# EAGLE design Lora Shield v1.1.1 (EAGLE 6.6.0)
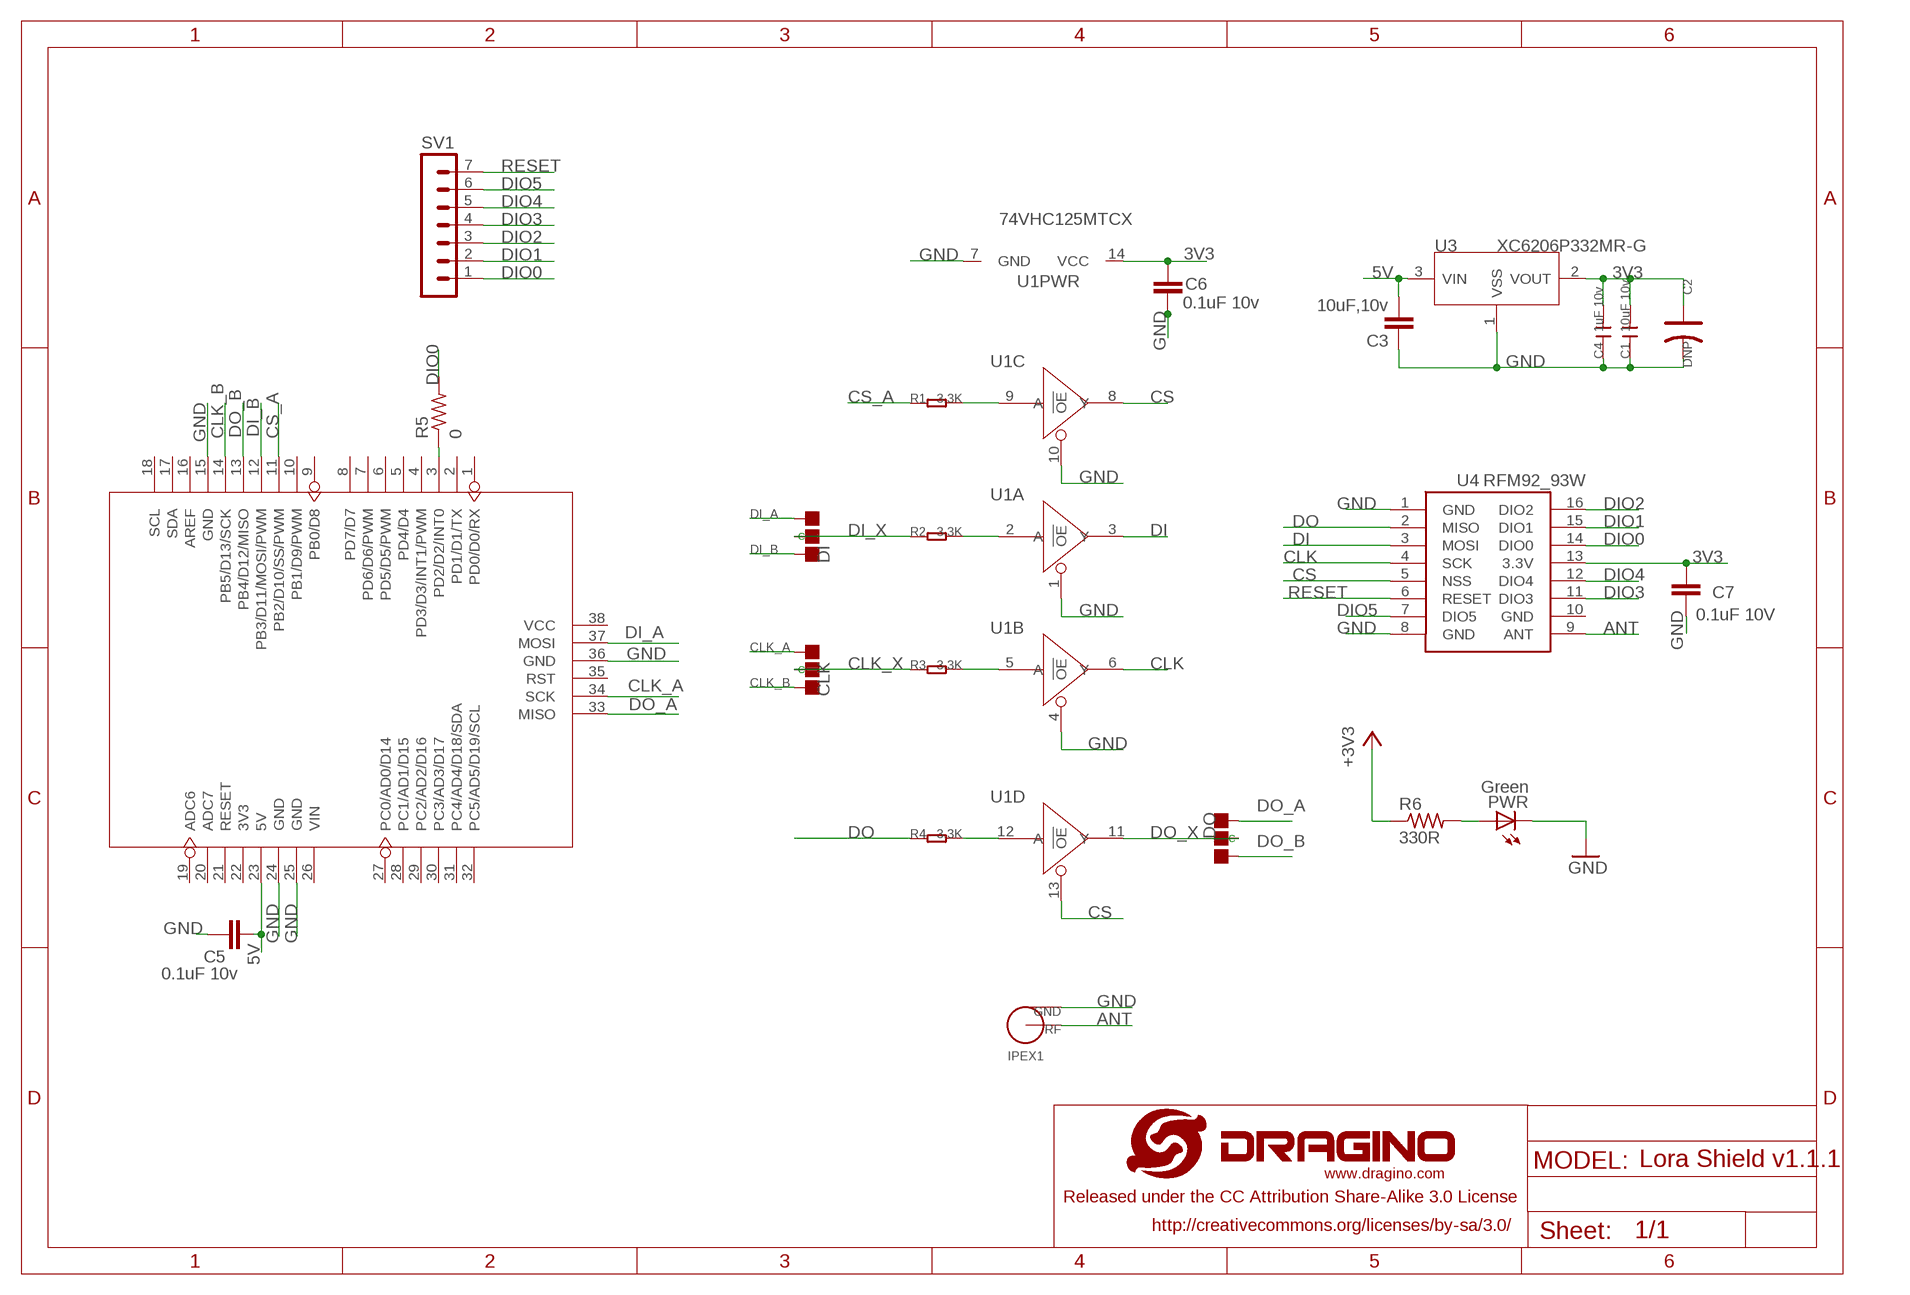
[diagram p0: schematic, sheet 1]

## Parts
C1  10uF 10v  C-0805  [C0805]
C2  DNP  CAP-AVX-A  [AVX-A]
C3  10uF,10v  C-EUC0805  [C0805]
C4  1uF 10v  C-0805  [C0805]
C5  0.1uF 10v  C-EUC0805  [C0805]
C6  0.1uF 10v  C-EUC0805  [C0805]
C7  0.1uF 10V  C-EUC0402  [C0402]
CLK  PAD-JUMPER-3P-40*40  [3P-SMD-4.1X1.5]
DI  PAD-JUMPER-3P-40*40  [3P-SMD-4.1X1.5]
DO  PAD-JUMPER-3P-40*40  [3P-SMD-4.1X1.5]
IPEX1  I-PEX  [I-PEX]
PWR  Green  LEDCHIP-LED0603  [CHIP-LED0603]
R1  3.3K  R-0603  [R0603]
R2  3.3K  R-0603  [R0603]
R3  3.3K  R-0603  [R0603]
R4  3.3K  R-0603  [R0603]
R5  0  R-US_R0603  [R0603]
R6  330R  R-US_R0402  [R0402]
SV1  MA07-1  [MA07-1]
U1  74VHC125MTCX  74VHC125PW  [TSSOP14]
U3  XC6206P332MR-G  XC6206MR  [SOT23]
U4  RFM92_93W  [RFM92_93W]
U5  MOUDLE_ARDUINO-38PMOUDLE_ARDUIN-328P-S  [MOUDLE_ARDUINO-328P_S]
U$1  LOGO-NEW  [LOGO-SILK-NEW]

## Nets
3V3: C1.2 C2.+ C4.2 C6.2 C7.2 R6.1 U1.14(PWR:VCC) U3.2(VOUT) U4.13(3.3V) ; supply symbol labelled +3V3
5V: C3.2 C5.2 U3.3(VIN) U5.23(5V)
ANT: IPEX1.SIG U4.9(ANT)
CLK: U1.6(B:Y) U4.4(SCK)
CLK_A: CLK.00(L) U5.34(SCK)
CLK_B: CLK.11(R) U5.14(PB5/D13/SCK)
CLK_X: CLK.MM(C) R3.1
CS: U1.8(C:Y) U1.13(D:!OE) U4.5(NSS)
CS_A: R1.1 U5.11(PB2/D10/SS/PWM)
DI: U1.3(A:Y) U4.3(MOSI)
DI_A: DI.00(L) U5.37(MOSI)
DI_B: DI.11(R) U5.12(PB3/D11/MOSI/PWM)
DI_X: DI.MM(C) R2.1
DIO0: R5.2 SV1.1 U4.14(DIO0)
DIO1: SV1.2 U4.15(DIO1)
DIO2: SV1.3 U4.16(DIO2)
DIO3: SV1.4 U4.11(DIO3)
DIO4: SV1.5 U4.12(DIO4)
DIO5: SV1.6 U4.7(DIO5)
DO: R4.1 U4.2(MISO)
DO_A: DO.11(R) U5.33(MISO)
DO_B: DO.00(L) U5.13(PB4/D12/MISO)
DO_X: DO.MM(C) U1.11(D:Y)
GND: C1.1 C2.- C3.1 C4.1 C5.1 C6.1 C7.1 IPEX1.GND IPEX1.GND1(GND) PWR.C U1.1(A:!OE) U1.4(B:!OE) U1.7(PWR:GND) U1.10(C:!OE) U3.1(VSS) U4.1(GND) U4.8(GND) U5.15(GND) U5.24(GND) U5.25(GND) U5.36(GND)
N$1: R5.1 U5.3(PD2/D2/INT0)
N$2: R4.2 U1.12(D:A)
N$3: R3.2 U1.5(B:A)
N$4: R2.2 U1.2(A:A)
N$5: R1.2 U1.9(C:A)
N$6: PWR.A R6.2
RESET: SV1.7 U4.6(RESET)
Unconnected: U5.1(PD0/D0/RX) U5.2(PD1/D1/TX) U5.4(PD3/D3/INT1/PWM) U5.5(PD4/D4) U5.6(PD5/D5/PWM) U5.7(PD6/D6/PWM) U5.8(PD7/D7) U5.9(PB0/D8) U5.10(PB1/D9/PWM) U5.16(AREF) U5.17(SDA) U5.18(SCL) U5.19(ADC6) U5.20(ADC7) U5.21(RESET) U5.22(3V3) U5.26(VIN) U5.27(PC0/AD0/D14) U5.28(PC1/AD1/D15) U5.29(PC2/AD2/D16) U5.30(PC3/AD3/D17) U5.31(PC4/AD4/D18/SDA) U5.32(PC5/AD5/D19/SCL) U5.35(RST) U5.38(VCC)

## Power pins joined to a net without a drawn wire
GND: U4.10(GND)

## Library data of the parts
C1 C4 = Discrete:C*: Ceramic Capacitors
C2 = Discrete:CAP*: Electrolytic Capacitors,Tantalum Capacitors and Super Capacitors
C3 C6 C7 = dragino-passive:C-EU: CAPACITOR, European symbol
C5 = resistor:C-EU: CAPACITOR, European symbol
CLK DI DO = Discrete:PAD-JUMPER-3P; PARTNO: DNP
IPEX1 = dragino-passive:I-PEX: I-PEX, U.F.L connector
PWR = dragino:LED: LED OSRAM: - CHIPLED LG R971, LG N971, LY N971, LG Q971, LY Q971, LO R971, LY R971 LH N974, LH R974 LS Q976, LO Q976, LY Q976 LO Q996 - Hyper CHIPLED LW Q18S LB Q993, LB Q99A, LB R99A - SideLED LS A670, LO A670, LY A670, LG A670, LP A670 LB A673, LV A673, LT A673, LW A673 LH A674 LY A675 LS A676, LA A676, LO A676, LY A676, LW A676 LS A679, LY A679, LG A679 - Hyper Micro SIDELED® LS Y876, LA Y876, LO Y876, LY Y876 LT Y87S - SmartLED LW L88C, LW L88S LB L89C, LB L89S, LG L890 LS L89K, LO L89K, LY L89K LS L896, LA L896, LO L896, LY L896 - TOPLED LS T670, LO T670, LY T670, LG T670, LP T670 LSG T670, LSP T670, LSY T670, LOP T670, LYG T670 LG T671, LOG T671, LSG T671 LB T673, LV T673, LT T673, LW T673 LH T674 LS T676, LA T676, LO T676, LY T676, LB T676, LH T676, LSB T676, LW T676 LB T67C, LV T67C, LT T67C, LS T67K, LO T67K, LY T67K, LW E67C LS E67B, LA E67B, LO E67B, LY E67B, LB E67C, LV E67C, LT E67C LW T67C LS T679, LY T679, LG T679 LS T770, LO T770, LY T770, LG T770, LP T770 LB T773, LV T773, LT T773, LW T773 LH T774 LS E675, LA E675, LY E675, LS T675 LS T776, LA T776, LO T776, LY T776, LB T776 LHGB T686 LT T68C, LB T68C - Hyper Mini TOPLED® LB M676 - Mini TOPLED Santana® LG M470 LS M47K, LO M47K, LY M47K Source: http://www.osram.convergy.de LUXEON: - LUMILED® LXK2-PW12-R00, LXK2-PW12-S00, LXK2-PW14-U00, LXK2-PW14-V00 LXK2-PM12-R00, LXK2-PM12-S00, LXK2-PM14-U00 LXK2-PE12-Q00, LXK2-PE12-R00, LXK2-PE12-S00, LXK2-PE14-T00, LXK2-PE14-U00 LXK2-PB12-K00, LXK2-PB12-L00, LXK2-PB12-M00, LXK2-PB14-N00, LXK2-PB14-P00, LXK2-PB14-Q00 LXK2-PR12-L00, LXK2-PR12-M00, LXK2-PR14-Q00, LXK2-PR14-R00 LXK2-PD12-Q00, LXK2-PD12-R00, LXK2-PD12-S00 LXK2-PH12-R00, LXK2-PH12-S00 LXK2-PL12-P00, LXK2-PL12-Q00, LXK2-PL12-R00 Source: www.luxeon.com KINGBRIGHT: KA-3528ASYC Source: www.kingbright.com
R1-R4 = Discrete:R*
R5 = resistor:R-US_: RESISTOR, American symbol
R6 = dragino:R-US_: RESISTOR, American symbol
SV1 = con-lstb:MA07-1: PIN HEADER; OC_FARNELL: unknown; OC_NEWARK: unknown
U1 = IC:74V*125: Quad Buffer/Line Driver;3-state
U3 = IC:XC6206: LOW ESR Cap.Compatible Positive Voltage Regulators
U4 = dragino:RFM92_93W
U5 = board_arduino:MOUDLE_ARDUINO-38P
U$1 = dragino:LOGO-NEW

## Net classes
0 default: clearance 0.205 mm
2 gnd: width 0.305 mm, drill 0.305 mm, clearance 0.254 mm

## Board
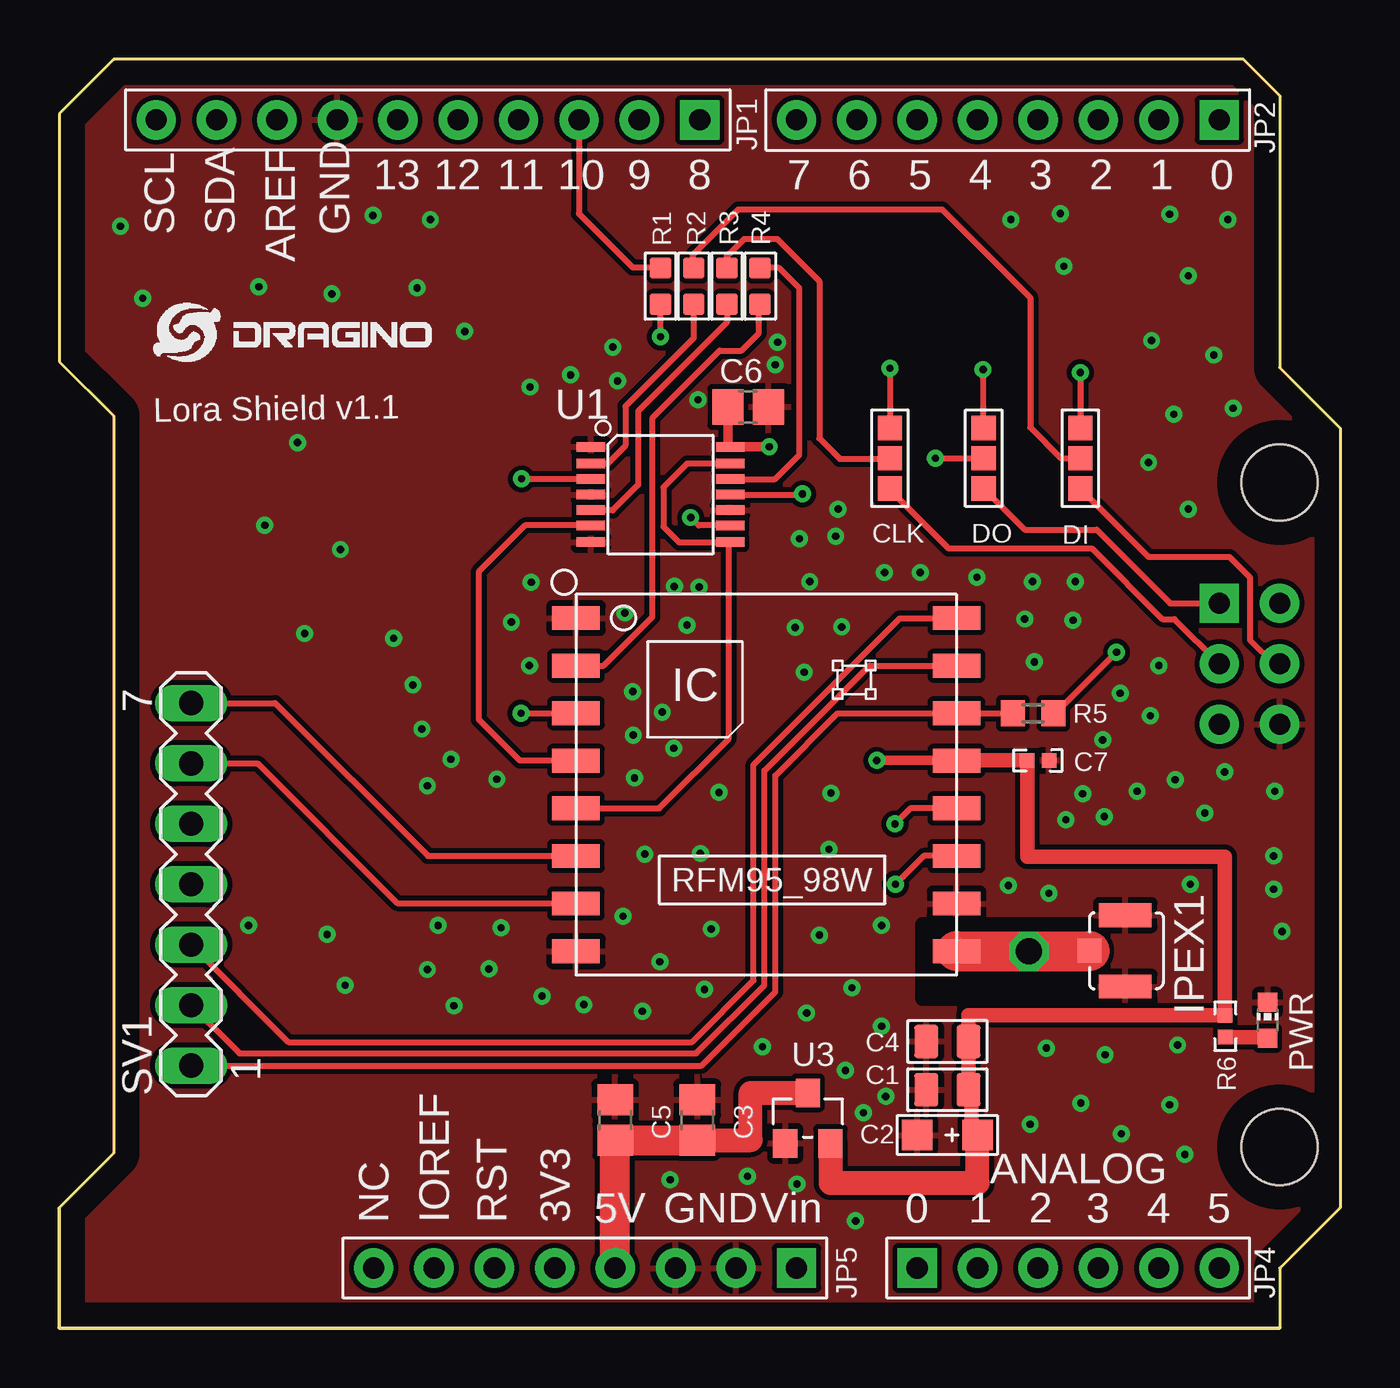
[diagram p1: board, top side]
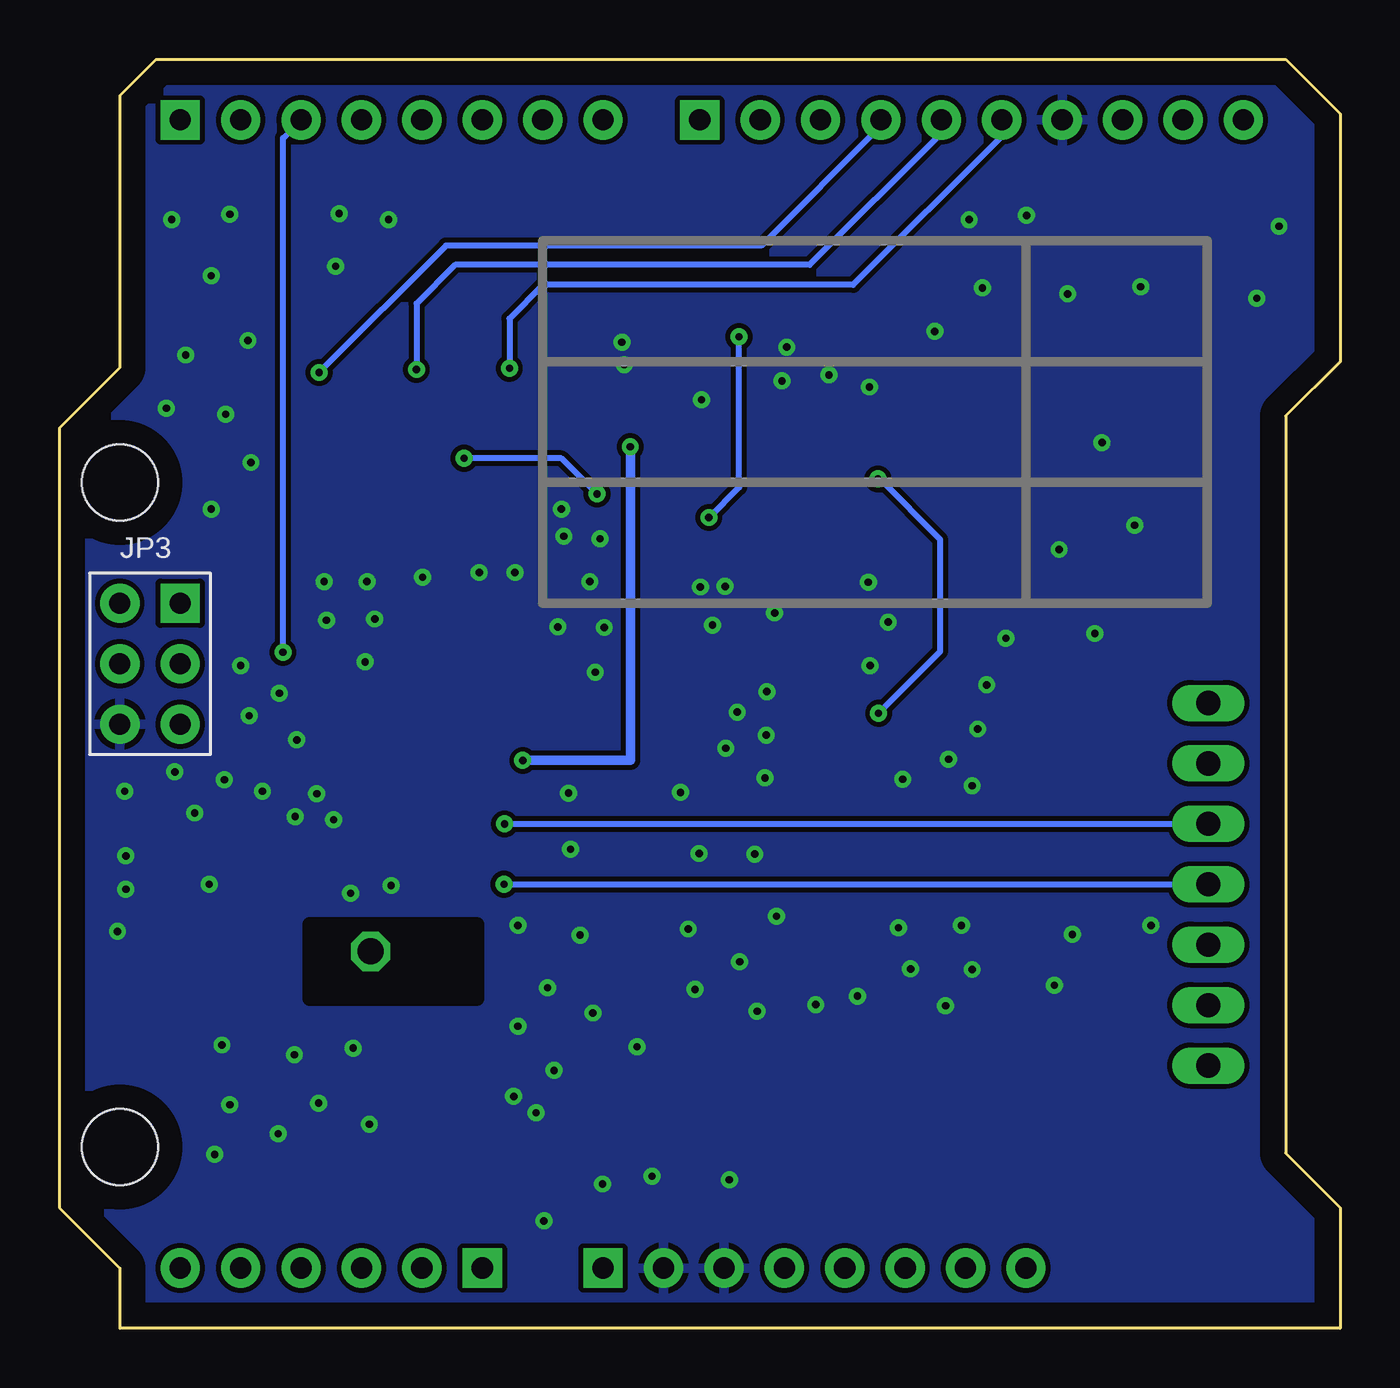
[diagram p2: board, bottom side, seen from below]

Size 53.85 x 53.34 mm. Coordinates in mm from the lower left corner, seen from the top.
Copper layers (1*16): Top 0.035mm / dielectric 1.5mm / Bottom 0.035mm
Design rules "default *": minimum track width 10mil, minimum drill 12mil, track to track 8mil, track to pad 8mil, pad to pad 8mil, via to via 8mil, smd to smd 8mil, copper to edge 40mil, drill to drill 8mil, minimum pad ring 10mil, minimum via ring 8mil, stop-mask expansion 4mil, vias tented up to drill 30mil, thermal gap 10mil
tRestrict: area 36.3,13.9 to 43.4,17
bRestrict: area 36.3,13.9 to 43.3,17

### Footprints (pad centres in the part's own frame; a part is rotated, then mirrored left to right if it is on the bottom)
C0805 = smd 1.016 x 1.397: 1 -0.889,0; 2 0.889,0
AVX-A = smd 1.27 x 1.27: + -1.27,0; - 1.27,0
C0805' = smd 1.3 x 1.5: 1 -0.85,0; 2 0.85,0
C0402 = smd 0.61 x 0.61: 1 -0.457,0; 2 0.457,0
3P-SMD-4.1X1.5 = smd 1.016 x 1.016: 00 -1.27,0; 11 1.27,0; MM 0,0
I-PEX = smd 1 x 2.2: GND -1.65,-0.27; GND1 1.35,-0.27 | smd 1 x 1: SIG -0.15,-1.77
CHIP-LED0603 = smd 0.8 x 0.8: A 0,-0.75; C 0,0.75
R0603 = smd 0.889 x 0.889: 1 -0.762,0; 2 0.762,0
R0603' = smd 1 x 1.1: 1 -0.85,0; 2 0.85,0
R0402 = smd 0.61 x 0.61: 1 -0.457,0; 2 0.457,0
MA07-1 = drill 1.016 long: 1 -7.62,0; 2 -5.08,0; 3 -2.54,0; 4 0,0; 5 2.54,0; 6 5.08,0; 7 7.62,0
TSSOP14 = smd 0.4 x 1.2: 1 -2,-2.925; 2 -1.3,-2.925; 3 -0.65,-2.925; 4 0,-2.925; 5 0.65,-2.925; 6 1.3,-2.925; 7 2,-2.925; 8 2,2.925; 9 1.3,2.925; 10 0.65,2.925; 11 0,2.925; 12 -0.65,2.925; 13 -1.3,2.925; 14 -2,2.925
SOT23 = smd 1.016 x 1.2: 1 -0.95,-1.06; 2 0.95,-1.06; 3 0,1.06
RFM92_93W = smd 2 x 1: 1 -8,7; 2 -8,5; 3 -8,3; 4 -8,1; 5 -8,-1; 6 -8,-3; 7 -8,-5; 8 -8,-7; 9 8,-7; 10 8,-5; 11 8,-3; 12 8,-1; 13 8,1; 14 8,3; 15 8,5; 16 8,7
MOUDLE_ARDUINO-328P_S = drill 0.889 pad 1.651 square: 1 26.67,24.13; 9 4.826,24.13; 26 8.89,-24.13; 27 13.97,-24.13; 33 26.67,3.81 | drill 0.889 pad 1.651: 2 24.13,24.13; 3 21.59,24.13; 4 19.05,24.13; 5 16.51,24.13; 6 13.97,24.13; 7 11.43,24.13; 8 8.89,24.13; 10 2.286,24.13; 11 -0.254,24.13; 12 -2.794,24.13; 13 -5.334,24.13; 14 -7.874,24.13; 15 -10.414,24.13; 16 -12.954,24.13; 17 -15.494,24.13; 18 -18.034,24.13; 19 -8.89,-24.13; 20 -6.35,-24.13; 21 -3.81,-24.13; 22 -1.27,-24.13; 23 1.27,-24.13; 24 3.81,-24.13; 25 6.35,-24.13; 28 16.51,-24.13; 29 19.05,-24.13; 30 21.59,-24.13; 31 24.13,-24.13; 32 26.67,-24.13; 34 26.67,1.27; 35 26.67,-1.27; 36 29.21,-1.27; 37 29.21,1.27; 38 29.21,3.81 | hole 3.2: 29.21,8.89; 29.21,-19.05

### Placement (x,y rotation side)
C1  37.34,10.03 0 top
C2  37.34,8.13 180 top
C3  10uF,10v  [C0805']  26.82,8.76 270 top
C4  37.34,12.07 0 top
C5  0.1uF 10v  [C0805']  23.37,8.76 270 top
C6  0.1uF 10v  [C0805']  28.96,38.73 180 top
C7  41.15,23.88 180 top
CLK  34.92,36.58 90 top
DI  42.93,36.58 90 top
DO  38.86,36.58 270 top
IPEX1  45.08,15.72 270 top
PWR  50.8,12.95 0 top
R1  25.27,43.81 270 top
R2  26.67,43.81 270 top
R3  28.07,43.81 270 top
R4  29.46,43.81 90 top
R5  0  [R0603']  40.94,25.86 180 top
R6  49.02,12.7 270 top
SV1  5.54,18.67 90 top
U1  25.27,35.05 270 top
U3  31.47,8.84 0 top
U4  29.72,22.86 0 top
U5  22.1,26.67 0 top
U$1  3.94,40.64 0 top

### Tracks (layer width: path | path; a pad name or v marks a point on that pad's centre or on a via)
3V3  (via drill 0.3)
  Top 0.406: C6.2 28.11,37.05 U1.14 v29.84,37.06 | 37.72,23.88 v34.37,23.88
  Top 0.61: C2.+ 38.35,8.13 38.35,10.03 C1.2 C4.2 38.23,13.16 R6.1 49,13.16 49,19.84 40.69,19.84 C7.2 37.72,23.88 U4.13
  Top 1.016: U3.2 32.42,6.12 38.61,6.12 C2.+
  Bottom 0.406: v34.37,23.88 29.84,23.88 v29.84,37.06
5V
  Top 1.016: C3.2 29.06,7.91 29.06,9.91 U3.3
  Top 1.27: U5.23 C5.2 C3.2
ANT  (via drill 1.1)
  Top 0.254: IPEX1.SIG v40.77,15.86 v40.77,15.85
  Top 1.676: U4.9 IPEX1.SIG
CLK
  Top 0.254: U4.4 21.22,23.86 21.21,23.88 19.35,23.88 17.63,25.6 17.63,31.8 19.58,33.75 U1.6
CLK_A
  Top 0.254: CLK.00 34.92,35.25 37.39,32.79 43.41,32.79 46.38,29.82 46.89,29.82 U5.34
CLK_B  (via drill 0.3)
  Top 0.254: v34.92,40.36 CLK.11
  Bottom 0.254: U5.14 14.22,50.11 20.47,43.87 33.5,43.87 34.92,42.44 v34.92,40.36
CLK_X
  Top 0.254: 28.07,44.7 R3.1 28.07,45.06 28.8,45.8 30.17,45.8 31.95,44.02 31.95,37.41 32.82,36.55 34.9,36.55 CLK.MM
CS
  Top 0.254: 21.07,21.86 U4.5 25.21,21.86 28.14,24.79 28.14,33 U1.8 26.06,33.05 25.4,33.71 25.4,35.36 26.39,36.35 U1.13
CS_A
  Top 0.254: U5.11 21.84,46.86 24.1,44.6 25.25,44.6 R1.1
DI  (via drill 0.3)
  Top 0.254: U1.3 19.44,35.7 v19.43,35.71 | v19.41,25.86 U4.3
  Bottom 0.254: v19.43,35.71 19.35,35.71 16.81,33.17 16.81,28.45 v19.41,25.86
DI_A
  Top 0.254: DI.00 45.8,32.44 49.2,32.44 50.06,31.57 50.06,28.93 51.05,27.94 U5.37
DI_B  (via drill 0.3)
  Top 0.254: v42.93,40.18 DI.11
  Bottom 0.254: U5.12 19.3,50.55 24.33,45.52 37.59,45.52 v42.93,40.18
DI_X
  Top 0.254: R2.1 26.64,44.6 26.64,45.14 28.55,47.04 37.11,47.04 40.82,43.33 40.82,37.87 42.11,36.58 DI.MM
DIO0
  Top 0.254: SV1.1 27,11.05 30.1,14.15 30.1,23.24 32.71,25.86 U4.14 R5.2
DIO1
  Top 0.254: U4.15 34.06,27.86 29.64,23.44 29.64,14.43 26.77,11.56 7.57,11.56 SV1.2
DIO2
  Top 0.254: 37.8,29.95 U4.16 37.7,29.84 35.33,29.84 29.18,23.7 29.18,14.63 26.59,12.04 9.63,12.04 SV1.3
DIO3  (via drill 0.3)
  Top 0.254: U4.11 36.34,19.86 v35.15,18.67
  Bottom 0.254: v35.15,18.67 SV1.4
DIO4  (via drill 0.3)
  Top 0.254: U4.12 35.78,21.86 v35.13,21.21
  Bottom 0.254: v35.13,21.21 SV1.5
DIO5
  Top 0.254: SV1.6 8.33,23.75 14.2,17.88 21.7,17.88 U4.7
DO
  Top 0.254: U4.2 22.88,27.86 24.92,29.9 24.92,38.25 27.76,41.1 28.68,41.1 29.41,41.83 29.41,43 R4.1
DO_A
  Top 0.254: DO.11 40.59,33.58 43.61,33.58 46.71,30.48 U5.33
DO_B  (via drill 0.3)
  Top 0.254: v38.84,40.31 38.84,37.87 DO.00
  Bottom 0.254: U5.13 16.76,50.24 22.3,44.7 37.21,44.7 38.84,43.08 v38.84,40.31
DO_X  (via drill 0.3)
  Top 0.254: U1.11 31.22,35.05 v31.24,35.08 | v36.83,36.58 DO.MM
  Bottom 0.254: v31.24,35.08 32.74,36.58 v36.83,36.58
GND  (via drill 0.3)
  Top 0.254: 29.59,38.86 29.46,38.73
  other vias: 30.1,40.51 30.2,41.45 26.85,39.04 23.47,39.83 21.49,40.08 19.79,39.57 13.18,46.79 15.6,46.61 23.27,41.25 31.11,33.2 32.64,33.3 32.74,34.44 31.55,31.39 34.7,31.78 36.19,31.78 38.58,31.57 40.92,31.39 42.72,31.39 42.62,29.77 40.59,29.82 10.31,29.21 14.05,29.01 14.86,27.05 16.46,23.93 19.84,31.37 19,29.69 19.76,27.86 23.77,30.07 25.86,31.19 26.9,31.17 26.39,29.57 24.1,26.77 24.13,24.94 24.18,23.14 25.83,24.38 25.35,25.91 18.39,23.09 15.24,25.2 15.47,22.81 18.57,16.84 15.93,16.94 15.47,15.09 18.06,15.11 20.29,13.97 16.59,13.56 7.95,16.94 11.25,16.56 12.01,14.43 24.51,13.34 23.7,17.32 27.41,16.79 25.25,15.42 27.13,14.25 22.05,13.61 24.61,19.94 26.95,19.96 27.74,22.53 30.94,29.46 32.89,29.49 31.32,27.58 32.44,22.5 32.36,20.14 31.95,16.54 34.57,16.94 33.32,14.33 34.57,12.7 31.42,13.26 29.57,11.84 33.05,10.85 31.01,6.07 28.93,6.4 25.68,6.25 33.48,4.52 33.81,9.07 34.75,9.75 41.5,11.79 42.95,9.47 40.82,8.59 44.65,8.18 46.69,9.4 43.97,11.51 47.02,11.91 47.32,7.32 39.9,18.62 41.61,18.29 47.55,18.67 43.94,21.51 43.03,22.48 42.32,21.39 43.87,24.74 45.31,22.58 48.16,21.67 51.1,22.58 51.05,19.86 51.05,18.47 51.41,16.69 49,23.39 45.87,25.76 46.91,23.06 46.23,27.86 44.6,26.7 41,28.02 40,46.61 42.09,46.86 42.24,44.65 46.69,46.84 49.12,46.61 47.47,44.25 45.92,41.53 48.54,40.92 46.86,38.43 47.47,34.44 45.8,36.4 49.35,38.68 8.64,33.76 11.81,32.74 10.01,37.24 8.38,43.79 11.46,43.48 15.04,43.74 17.04,41.91 2.57,46.33 3.51,43.31
  pour Top: -0.38,53.59 54.48,53.85 54.23,-0.25 -0.13,-0.25 -0.38,52.58
  pour Bottom: -0.28,53.62 -0.53,-0.3 53.54,-0.43 54.08,-0.41 54.48,53.62 48.84,53.64
N$1  (via drill 0.3)
  Top 0.254: R5.1 41.88,25.86 v44.45,28.42
  Bottom 0.254: v44.45,28.42 44.45,50.04 U5.3
N$2
  Top 0.254: U1.12 30.09,35.7 31.11,36.73 31.11,43.71 30.25,44.58 R4.2
N$3
  Top 0.254: R3.2 28.07,42.29 24.33,38.56 24.33,35.46 23.27,34.39 U1.5
N$4
  Top 0.254: R2.2 26.67,41.63 23.8,38.76 23.8,37.11 23.04,36.35 U1.2
N$5  (via drill 0.3)
  Top 0.254: U1.9 26.88,33.75 v26.54,34.09 | v25.27,41.68 R1.2
  Bottom 0.254: v26.54,34.09 25.27,35.36 v25.27,41.68
N$6
  Top 0.61: R6.2 50.8,12.24 PWR.A
RESET
  Top 0.254: SV1.7 9.07,26.29 15.49,19.86 U4.6

### Text on the board
tNames: Lora Shield v1.1
tDocu: RESET | DIO5 | DIO4 | DIO3 | DIO2 | DIO1 | DIO0
bDocu: 433MHZ | 868MHZ | 915MHZ